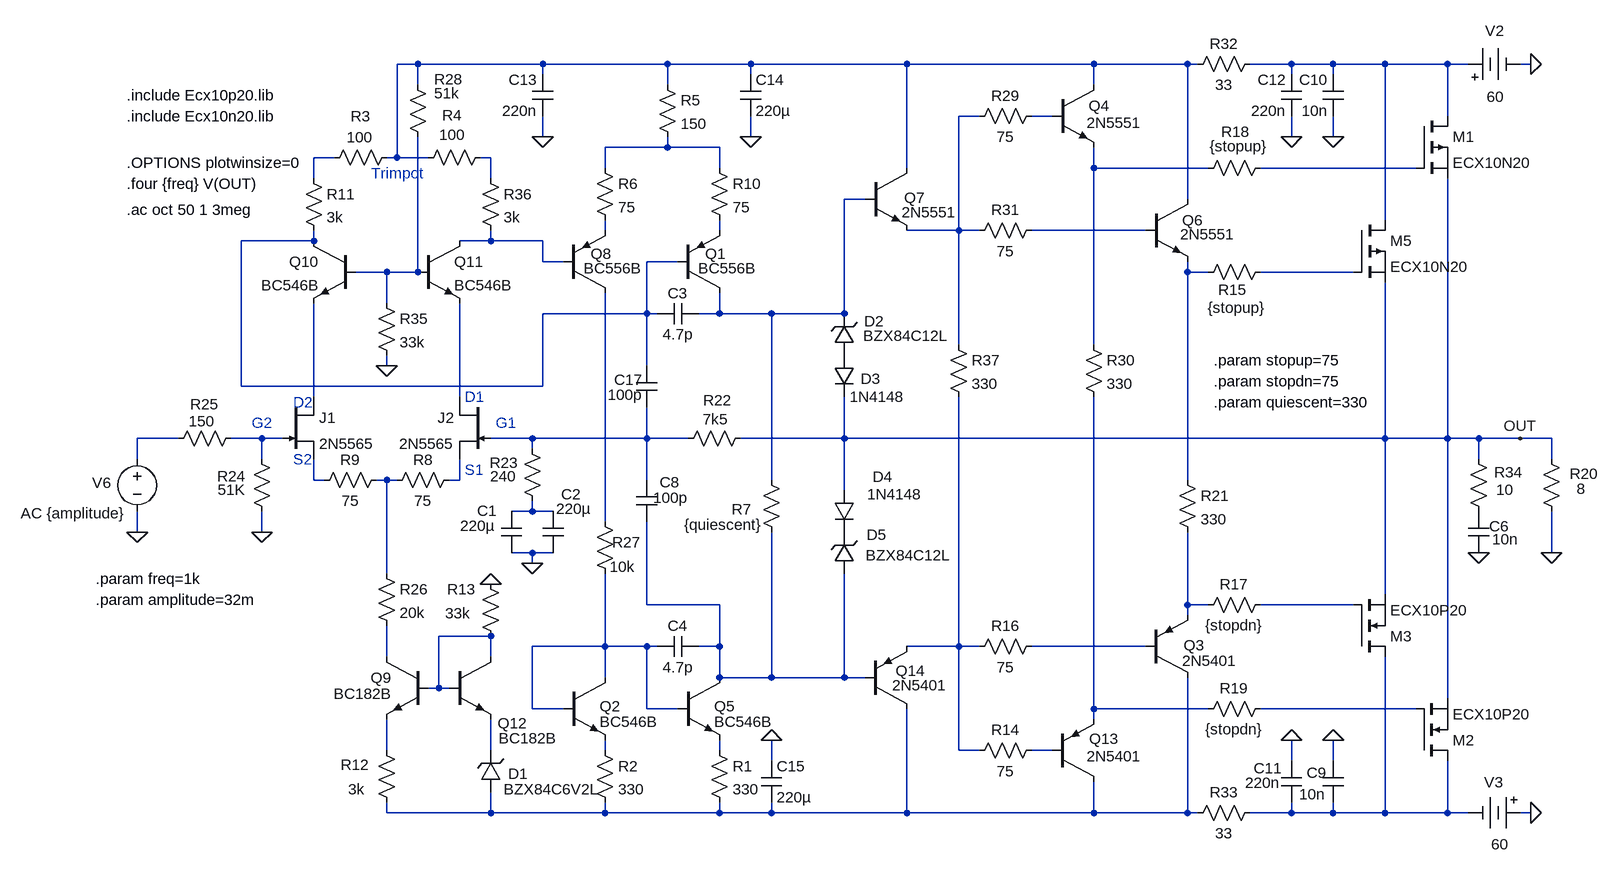
[diagram p0: schematic Mimesis 330 Clon Rodrigo con Exicon y 2N5565.asc]
Mimesis 330 Clon Rodrigo con Exicon y 2N5565.asc, the LTspice schematic file:
Version 4
SHEET 1 3760 2268
WIRE -1136 -144 -1168 -144
WIRE -944 -144 -1136 -144
WIRE -752 -144 -944 -144
WIRE -624 -144 -752 -144
WIRE -384 -144 -624 -144
WIRE -96 -144 -384 -144
WIRE 48 -144 -96 -144
WIRE 64 -144 48 -144
WIRE 208 -144 144 -144
WIRE 272 -144 208 -144
WIRE 352 -144 272 -144
WIRE 448 -144 352 -144
WIRE 480 -144 448 -144
WIRE 576 -144 560 -144
WIRE -944 -128 -944 -144
WIRE -624 -128 -624 -144
WIRE 208 -128 208 -144
WIRE 272 -128 272 -144
WIRE -1136 -112 -1136 -144
WIRE -752 -112 -752 -144
WIRE -96 -112 -96 -144
WIRE -272 -64 -304 -64
WIRE -160 -64 -192 -64
WIRE 448 -64 448 -144
WIRE -944 -32 -944 -64
WIRE -624 -32 -624 -64
WIRE 208 -32 208 -64
WIRE 272 -32 272 -64
WIRE -752 -16 -752 -32
WIRE -752 -16 -848 -16
WIRE -672 -16 -752 -16
WIRE -1264 0 -1296 0
WIRE -1168 0 -1168 -144
WIRE -1168 0 -1184 0
WIRE -1120 0 -1168 0
WIRE -1024 0 -1040 0
WIRE -848 16 -848 -16
WIRE -672 16 -672 -16
WIRE -384 16 -384 -144
WIRE -96 16 -96 -16
WIRE 80 16 -96 16
WIRE 400 16 160 16
WIRE -1296 32 -1296 0
WIRE -1024 32 -1024 0
WIRE -448 64 -480 64
WIRE 48 64 48 -144
WIRE 352 96 352 -144
WIRE -848 112 -848 96
WIRE -672 112 -672 96
WIRE -304 112 -304 -64
WIRE -304 112 -384 112
WIRE -272 112 -304 112
WIRE -16 112 -192 112
WIRE -1296 128 -1296 112
WIRE -1296 128 -1408 128
WIRE -1024 128 -1024 112
WIRE -1024 128 -1072 128
WIRE -944 128 -1024 128
WIRE -944 160 -944 128
WIRE -912 160 -944 160
WIRE -736 160 -784 160
WIRE -1184 176 -1232 176
WIRE -1136 176 -1136 -32
WIRE -1136 176 -1184 176
WIRE 48 176 48 160
WIRE 80 176 48 176
WIRE 304 176 160 176
WIRE -1184 224 -1184 176
WIRE -784 240 -784 160
WIRE -784 240 -944 240
WIRE -768 240 -784 240
WIRE -672 240 -672 208
WIRE -672 240 -704 240
WIRE -592 240 -672 240
WIRE -480 240 -480 64
WIRE -480 240 -592 240
WIRE -304 288 -304 112
WIRE -96 288 -96 16
WIRE -1184 320 -1184 304
WIRE -784 320 -784 240
WIRE -1408 352 -1408 128
WIRE -944 352 -944 240
WIRE -944 352 -1408 352
WIRE -1296 368 -1296 224
WIRE -1072 368 -1072 224
WIRE -1504 432 -1568 432
WIRE -1376 432 -1424 432
WIRE -1344 432 -1376 432
WIRE -960 432 -1024 432
WIRE -784 432 -784 384
WIRE -784 432 -960 432
WIRE -720 432 -784 432
WIRE -480 432 -480 368
WIRE -480 432 -640 432
WIRE 352 432 352 192
WIRE 352 432 -480 432
WIRE 448 432 448 32
WIRE 448 432 352 432
WIRE 496 432 448 432
WIRE 560 432 496 432
WIRE 608 432 560 432
WIRE -960 448 -960 432
WIRE -1568 464 -1568 432
WIRE -1376 464 -1376 432
WIRE 496 464 496 432
WIRE 608 464 608 432
WIRE -1296 496 -1296 464
WIRE -1280 496 -1296 496
WIRE -1184 496 -1200 496
WIRE -1168 496 -1184 496
WIRE -1072 496 -1072 464
WIRE -1072 496 -1088 496
WIRE -784 496 -784 432
WIRE -592 496 -592 240
WIRE 48 496 48 176
WIRE -480 512 -480 432
WIRE -960 544 -960 528
WIRE -960 544 -992 544
WIRE -928 544 -960 544
WIRE -848 560 -848 208
WIRE -1568 576 -1568 544
WIRE -1376 576 -1376 544
WIRE -960 608 -992 608
WIRE -928 608 -960 608
WIRE 608 608 608 544
WIRE -960 624 -960 608
WIRE -1184 640 -1184 496
WIRE 352 672 352 432
WIRE -784 688 -784 560
WIRE -672 688 -784 688
WIRE 48 688 48 576
WIRE 80 688 48 688
WIRE 304 688 160 688
WIRE 48 704 48 688
WIRE -1024 736 -1104 736
WIRE -848 752 -848 640
WIRE -848 752 -960 752
WIRE -784 752 -848 752
WIRE -768 752 -784 752
WIRE -672 752 -672 688
WIRE -672 752 -704 752
WIRE -304 752 -304 368
WIRE -304 752 -384 752
WIRE -272 752 -304 752
WIRE -16 752 -192 752
WIRE -1184 768 -1184 720
WIRE -1024 768 -1024 736
WIRE -848 800 -848 752
WIRE -672 800 -672 752
WIRE -592 800 -592 576
WIRE -592 800 -672 800
WIRE -480 800 -480 640
WIRE -480 800 -592 800
WIRE -448 800 -480 800
WIRE -1104 816 -1104 736
WIRE -1104 816 -1120 816
WIRE -1088 816 -1104 816
WIRE 448 832 448 432
WIRE -960 848 -960 752
WIRE -912 848 -960 848
WIRE -784 848 -784 752
WIRE -736 848 -784 848
WIRE -96 848 -96 368
WIRE 80 848 -96 848
WIRE 400 848 160 848
WIRE -96 864 -96 848
WIRE -1184 912 -1184 864
WIRE -1024 912 -1024 864
WIRE -848 912 -848 896
WIRE -672 912 -672 896
WIRE -304 912 -304 752
WIRE -272 912 -304 912
WIRE -160 912 -192 912
WIRE -592 928 -592 896
WIRE 208 928 208 896
WIRE 272 928 272 896
WIRE -1184 1008 -1184 992
WIRE -1024 1008 -1024 976
WIRE -1024 1008 -1184 1008
WIRE -848 1008 -848 992
WIRE -848 1008 -1024 1008
WIRE -672 1008 -672 992
WIRE -672 1008 -848 1008
WIRE -592 1008 -592 992
WIRE -592 1008 -672 1008
WIRE -384 1008 -384 848
WIRE -384 1008 -592 1008
WIRE -96 1008 -96 960
WIRE -96 1008 -384 1008
WIRE 48 1008 48 800
WIRE 48 1008 -96 1008
WIRE 64 1008 48 1008
WIRE 208 1008 208 992
WIRE 208 1008 144 1008
WIRE 272 1008 272 992
WIRE 272 1008 208 1008
WIRE 352 1008 352 768
WIRE 352 1008 272 1008
WIRE 448 1008 448 928
WIRE 448 1008 352 1008
WIRE 480 1008 448 1008
WIRE 576 1008 560 1008
FLAG 576 -144 0
FLAG 576 1008 0
FLAG 608 608 0
FLAG -1184 320 0
FLAG -1024 656 0
FLAG -1376 576 0
FLAG -1568 576 0
FLAG -960 624 0
FLAG 560 432 OUT
FLAG 496 608 0
FLAG 272 896 0
FLAG 272 -32 0
FLAG 208 896 0
FLAG 208 -32 0
FLAG -944 -32 0
FLAG -624 -32 0
FLAG -592 896 0
DATAFLAG 16 432 ""
SYMBOL res -688 896 R0
SYMATTR InstName R1
SYMATTR Value 330
SYMBOL res -864 896 R0
SYMATTR InstName R2
SYMATTR Value 330
SYMBOL res -1072 480 R90
WINDOW 0 0 56 VBottom 2
WINDOW 3 32 56 VTop 2
SYMATTR InstName R8
SYMATTR Value 75
SYMBOL res -1184 480 R90
WINDOW 0 0 56 VBottom 2
WINDOW 3 32 56 VTop 2
SYMATTR InstName R9
SYMATTR Value 75
SYMBOL npn -1232 128 M0
SYMATTR InstName Q10
SYMATTR Value BC546B
SYMBOL npn -1136 128 R0
SYMATTR InstName Q11
SYMATTR Value BC546B
SYMBOL res -1312 16 R0
SYMATTR InstName R11
SYMATTR Value 3k
SYMBOL Misc\\battery 464 -144 R270
WINDOW 123 0 0 Left 2
WINDOW 0 51 42 VRight 2
WINDOW 3 -50 44 VRight 2
SYMATTR InstName V2
SYMATTR Value 60
SYMATTR SpiceLine Rser=0
SYMBOL Misc\\battery 576 1008 R90
WINDOW 123 0 0 Left 2
WINDOW 0 -47 42 VRight 2
WINDOW 3 48 34 VRight 2
SYMATTR InstName V3
SYMATTR Value 60
SYMATTR SpiceLine Rser=0
SYMBOL res 624 560 R180
WINDOW 0 -56 74 Left 2
WINDOW 3 -36 51 Left 2
SYMATTR InstName R20
SYMATTR Value 8
SYMBOL res 32 480 R0
SYMATTR InstName R21
SYMATTR Value 330
SYMBOL res -1392 448 R0
WINDOW 0 -53 42 Left 2
WINDOW 3 -52 63 Left 2
SYMATTR InstName R24
SYMATTR Value 51K
SYMBOL res -1408 416 R90
WINDOW 0 -21 56 VBottom 2
WINDOW 3 -26 60 VTop 2
SYMATTR InstName R25
SYMATTR Value 150
SYMBOL res -768 -128 R0
SYMATTR InstName R5
SYMATTR Value 150
SYMBOL res -864 544 R0
WINDOW 0 27 48 Left 2
WINDOW 3 23 85 Left 2
SYMATTR InstName R27
SYMATTR Value 10k
SYMBOL res -1200 208 R0
SYMATTR InstName R35
SYMATTR Value 33k
SYMBOL npn -1120 768 M0
WINDOW 3 56 57 Left 2
SYMATTR Value BC182B
SYMATTR InstName Q9
SYMBOL npn -1088 768 R0
WINDOW 0 75 102 Left 2
WINDOW 3 76 125 Left 2
SYMATTR InstName Q12
SYMATTR Value BC182B
SYMBOL res -1200 896 R0
WINDOW 0 -55 38 Left 2
WINDOW 3 -43 76 Left 2
SYMATTR InstName R12
SYMATTR Value 3k
SYMBOL res -1040 640 R0
WINDOW 0 -51 24 Left 2
WINDOW 3 -54 61 Left 2
SYMATTR InstName R13
SYMATTR Value 33k
SYMBOL res -1200 624 R0
SYMATTR InstName R26
SYMATTR Value 20k
SYMBOL res -624 416 R90
WINDOW 0 -27 51 VBottom 2
WINDOW 3 -29 54 VTop 2
SYMATTR InstName R22
SYMATTR Value 7k5
SYMBOL res -944 544 R180
WINDOW 0 37 75 Left 2
WINDOW 3 40 54 Left 2
SYMATTR InstName R23
SYMATTR Value 240
SYMBOL zener -1008 976 R180
WINDOW 0 -42 28 Left 2
WINDOW 3 -151 4 Left 2
SYMATTR InstName D1
SYMATTR Value BZX84C6V2L
SYMATTR Description Diode
SYMATTR Type diode
SYMBOL res -1168 -16 R90
WINDOW 0 -32 56 VBottom 2
WINDOW 3 -31 57 VTop 2
SYMATTR InstName R3
SYMATTR Value 100
SYMBOL res -1024 -16 R90
WINDOW 0 -34 59 VBottom 2
WINDOW 3 -35 59 VTop 2
SYMATTR InstName R4
SYMATTR Value 100
SYMBOL res -1040 16 R0
SYMATTR InstName R36
SYMATTR Value 3k
SYMBOL res -864 0 R0
SYMATTR InstName R6
SYMATTR Value 75
SYMBOL res -688 0 R0
SYMATTR InstName R10
SYMATTR Value 75
SYMBOL diode -496 304 R0
WINDOW 0 41 36 Left 2
SYMATTR InstName D3
SYMATTR Value 1N4148
SYMBOL diode -496 512 R0
WINDOW 0 60 -21 Left 2
WINDOW 3 51 6 Left 2
SYMATTR InstName D4
SYMATTR Value 1N4148
SYMBOL zener -464 304 R180
WINDOW 0 -45 52 Left 2
WINDOW 3 -144 30 Left 2
SYMATTR InstName D2
SYMATTR Value BZX84C12L
SYMATTR Description Diode
SYMATTR Type diode
SYMBOL zener -464 640 R180
WINDOW 0 -49 60 Left 2
WINDOW 3 -148 28 Left 2
SYMATTR InstName D5
SYMATTR Value BZX84C12L
SYMATTR Description Diode
SYMATTR Type diode
SYMBOL res 176 160 R90
WINDOW 0 59 59 VBottom 2
WINDOW 3 55 52 VTop 2
SYMATTR InstName R15
SYMATTR Value {stopup}
SYMBOL res -608 480 R0
WINDOW 0 -45 61 Left 2
WINDOW 3 -118 85 Left 2
SYMATTR InstName R7
SYMATTR Value {quiescent}
SYMBOL res 176 672 R90
WINDOW 0 0 56 VBottom 2
WINDOW 3 32 56 VTop 2
SYMATTR InstName R17
SYMATTR Value {stopdn}
SYMBOL res 176 0 R90
WINDOW 0 -24 54 VBottom 2
WINDOW 3 -33 49 VTop 2
SYMATTR InstName R18
SYMATTR Value {stopup}
SYMBOL res 176 832 R90
WINDOW 0 0 56 VBottom 2
WINDOW 3 32 56 VTop 2
SYMATTR InstName R19
SYMATTR Value {stopdn}
SYMBOL pnp -912 208 M180
WINDOW 0 42 60 Left 2
WINDOW 3 31 38 Left 2
SYMATTR InstName Q8
SYMATTR Value BC556B
SYMBOL npn -912 800 R0
WINDOW 0 56 44 Left 2
SYMATTR InstName Q2
SYMATTR Value BC546B
SYMBOL npn -16 64 R0
WINDOW 3 53 54 Left 2
SYMATTR Value 2N5551
SYMATTR InstName Q6
SYMBOL pnp -16 800 M180
WINDOW 0 58 50 Left 2
WINDOW 3 56 26 Left 2
SYMATTR InstName Q3
SYMATTR Value 2N5401
SYMBOL pnp -160 960 M180
WINDOW 0 57 66 Left 2
WINDOW 3 53 39 Left 2
SYMATTR InstName Q13
SYMATTR Value 2N5401
SYMBOL npn -160 -112 R0
WINDOW 3 53 58 Left 2
SYMATTR Value 2N5551
SYMATTR InstName Q4
SYMBOL res -176 -80 R90
WINDOW 0 0 56 VBottom 2
WINDOW 3 32 56 VTop 2
SYMATTR InstName R29
SYMATTR Value 75
SYMBOL res -112 272 R0
SYMATTR InstName R30
SYMATTR Value 330
SYMBOL res -176 896 R90
WINDOW 0 0 56 VBottom 2
WINDOW 3 32 56 VTop 2
SYMATTR InstName R14
SYMATTR Value 75
SYMBOL res -176 736 R90
WINDOW 0 0 56 VBottom 2
WINDOW 3 32 56 VTop 2
SYMATTR InstName R16
SYMATTR Value 75
SYMBOL res -176 96 R90
WINDOW 0 0 56 VBottom 2
WINDOW 3 32 56 VTop 2
SYMATTR InstName R31
SYMATTR Value 75
SYMBOL voltage -1568 448 R0
WINDOW 0 -69 52 Left 2
WINDOW 3 -43 170 Left 2
WINDOW 123 -179 99 Left 2
WINDOW 39 0 0 Left 2
SYMATTR InstName V6
SYMATTR Value ""
SYMATTR Value2 AC {amplitude}
SYMBOL res 160 -160 R90
WINDOW 0 0 56 VBottom 2
WINDOW 3 32 56 VTop 2
SYMATTR InstName R32
SYMATTR Value 33
SYMBOL res 160 992 R90
WINDOW 0 0 56 VBottom 2
WINDOW 3 32 56 VTop 2
SYMATTR InstName R33
SYMATTR Value 33
SYMBOL cap -976 608 R180
WINDOW 0 38 65 Left 2
WINDOW 3 41 42 Left 2
SYMATTR InstName C1
SYMATTR Value 220µ
SYMBOL cap -912 608 R180
WINDOW 0 -27 90 Left 2
WINDOW 3 -43 68 Left 2
SYMATTR InstName C2
SYMATTR Value 220µ
SYMBOL res 512 560 R180
WINDOW 0 -52 76 Left 2
WINDOW 3 -38 49 Left 2
SYMATTR InstName R34
SYMATTR Value 10
SYMBOL cap 512 608 R180
WINDOW 0 -31 41 Left 2
WINDOW 3 -45 21 Left 2
SYMATTR InstName C6
SYMATTR Value 10n
SYMBOL cap -768 560 R180
WINDOW 0 -35 61 Left 2
WINDOW 3 -48 37 Left 2
SYMATTR InstName C8
SYMATTR Value 100p
SYMBOL cap 256 928 R0
WINDOW 0 -25 18 Left 2
WINDOW 3 -36 51 Left 2
SYMATTR InstName C9
SYMATTR Value 10n
SYMBOL cap 288 -64 R180
WINDOW 0 24 56 Left 2
WINDOW 3 24 8 Left 2
SYMATTR InstName C10
SYMATTR Value 10n
SYMBOL cap 192 928 R0
WINDOW 0 -42 11 Left 2
WINDOW 3 -55 34 Left 2
SYMATTR InstName C11
SYMATTR Value 220n
SYMBOL cap 224 -64 R180
WINDOW 0 24 56 Left 2
WINDOW 3 24 8 Left 2
SYMATTR InstName C12
SYMATTR Value 220n
SYMBOL cap -928 -64 R180
WINDOW 0 24 56 Left 2
WINDOW 3 24 8 Left 2
SYMATTR InstName C13
SYMATTR Value 220n
SYMBOL cap -640 -128 R0
SYMATTR InstName C14
SYMATTR Value 220µ
SYMBOL cap -608 928 R0
SYMATTR InstName C15
SYMATTR Value 220µ
SYMBOL nmos 400 928 M180
SYMATTR InstName M2
SYMATTR Value ECX10P20
SYMATTR Prefix X
SYMBOL pmos 304 96 R0
SYMATTR InstName M5
SYMATTR Value ECX10N20
SYMATTR Prefix X
SYMBOL pmos 400 -64 R0
SYMATTR InstName M1
SYMATTR Value ECX10N20
SYMATTR Prefix X
SYMBOL nmos 304 768 M180
SYMATTR InstName M3
SYMATTR Value ECX10P20
SYMATTR Prefix X
SYMBOL njf -1344 368 R0
SYMATTR InstName J1
SYMATTR Value 2N5565
SYMBOL njf -1024 368 M0
SYMATTR InstName J2
SYMATTR Value 2N5565
SYMBOL res -1152 -128 R0
WINDOW 0 41 7 Left 2
WINDOW 3 41 29 Left 2
SYMATTR InstName R28
SYMATTR Value 51k
SYMBOL cap -704 224 R90
WINDOW 0 0 32 VBottom 2
WINDOW 3 32 32 VTop 2
SYMATTR InstName C3
SYMATTR Value 4.7p
SYMBOL cap -704 736 R90
WINDOW 0 0 32 VBottom 2
WINDOW 3 32 32 VTop 2
SYMATTR InstName C4
SYMATTR Value 4.7p
SYMBOL cap -800 320 R0
WINDOW 0 -34 22 Left 2
WINDOW 3 -44 45 Left 2
SYMATTR InstName C17
SYMATTR Value 100p
SYMBOL npn -448 16 R0
WINDOW 0 60 46 Left 2
SYMATTR InstName Q7
SYMATTR Value 2N5551
SYMBOL res -320 272 R0
SYMATTR InstName R37
SYMATTR Value 330
SYMBOL pnp -448 848 M180
WINDOW 0 47 59 Left 2
WINDOW 3 42 36 Left 2
SYMATTR InstName Q14
SYMATTR Value 2N5401
SYMBOL pnp -736 208 M180
WINDOW 0 42 60 Left 2
WINDOW 3 31 38 Left 2
SYMATTR InstName Q1
SYMATTR Value BC556B
SYMBOL npn -736 800 R0
WINDOW 0 56 44 Left 2
SYMATTR InstName Q5
SYMATTR Value BC546B
TEXT -1584 80 Left 2 !.ac oct 50 1 3meg
TEXT -1584 40 Left 2 !.four {freq} V(OUT)
TEXT 88 312 Left 2 !.param stopup=75
TEXT 88 344 Left 2 !.param stopdn=75
TEXT -1632 648 Left 2 !.param freq=1k
TEXT -1632 680 Left 2 !.param amplitude=32m
TEXT 88 376 Left 2 !.param quiescent=330
TEXT -1584 8 Left 2 !.OPTIONS plotwinsize=0
TEXT -1584 -64 Left 2 !.include Ecx10n20.lib
TEXT -1584 -96 Left 2 !.include Ecx10p20.lib
TEXT -1016 408 Left 2 ;G1
TEXT -1064 368 Left 2 ;D1
TEXT -1064 480 Left 2 ;S1
TEXT -1392 408 Left 2 ;G2
TEXT -1328 376 Left 2 ;D2
TEXT -1328 464 Left 2 ;S2
TEXT -1208 24 Left 2 ;Trimpot

The netlist it stands for:
* Mimesis 330 Clon Rodrigo con Exicon y 2N5565.asc
R1 N042 N044 330
R2 N041 N044 330
R8 N026 N025 75
R9 N025 N024 75
Q10 N014 N016 N019 0 BC546B
Q11 N015 N016 N020 0 BC546B
R11 N006 N014 3k
V2 N002 0 60 Rser=0
V3 0 N045 60 Rser=0
R20 0 OUT 8
R21 N017 N030 330
R24 N022 0 51K
R25 N022 N021 150
R5 N001 N005 150
R27 N028 N033 10k
R35 N016 0 33k
Q9 N036 N032 N039 0 BC182B
Q12 N032 N032 N040 0 BC182B
R12 N039 N044 3k
R13 0 N032 33k
R26 N025 N036 20k
R22 OUT N023 7k5
R23 N027 N023 240
D1 N044 N040 BZX84C6V2L
R3 N001 N006 100
R4 N007 N001 100
R36 N007 N015 3k
R6 N005 N011 75
R10 N005 N012 75
D3 P001 OUT 1N4148
D4 OUT P002 1N4148
D2 P001 N010 BZX84C12L
D5 N029 P002 BZX84C12L
R15 N018 N017 {stopup}
R7 N010 N029 {quiescent}
R17 N031 N030 {stopdn}
R18 N009 N008 {stopup}
R19 N038 N037 {stopdn}
Q8 N028 N015 N011 0 BC556B
Q2 N033 N033 N041 0 BC546B
Q6 N001 N013 N017 0 2N5551
Q3 N044 N035 N030 0 2N5401
Q13 N044 N043 N037 0 2N5401
Q4 N001 N004 N008 0 2N5551
R29 N004 N003 75
R30 N008 N037 330
R14 N043 N034 75
R16 N035 N034 75
R31 N013 N003 75
V6 N021 0 AC {amplitude}
R32 N002 N001 33
R33 N045 N044 33
C1 0 N027 220µ
C2 0 N027 220µ
R34 P003 OUT 10
C6 0 P003 10n
C8 N029 N023 100p
C9 0 N045 10n
C10 0 N002 10n
C11 0 N045 220n
C12 0 N002 220n
C13 0 N001 220n
C14 N001 0 220µ
C15 0 N044 220µ
XM2 N045 N038 OUT ECX10P20  ; pins D G S
XM5 N002 N018 OUT ECX10N20  ; pins D G S
XM1 N002 N009 OUT ECX10N20  ; pins D G S
XM3 N045 N031 OUT ECX10P20  ; pins D G S
J1 N019 N022 N024 2N5565
J2 N020 N023 N026 2N5565
R28 N001 N016 51k
C3 N010 N014 4.7p
C4 N029 N033 4.7p
C17 N014 N023 100p
Q7 N001 N010 N003 0 2N5551
R37 N003 N034 330
Q14 N044 N029 N034 0 2N5401
Q1 N010 N014 N012 0 BC556B
Q5 N029 N033 N042 0 BC546B
.model D D
.lib standard.dio
.model NPN NPN
.model PNP PNP
.lib standard.bjt
.model NJF NJF
.model PJF PJF
.lib standard.jft
.ac oct 50 1 3meg
.four {freq} V(OUT)
.param stopup=75
.param stopdn=75
.param freq=1k
.param amplitude=32m
.param quiescent=330
.OPTIONS plotwinsize=0
.include Ecx10n20.lib
.include Ecx10p20.lib
* G1
* D1
* S1
* G2
* D2
* S2
* Trimpot
.backanno
.end